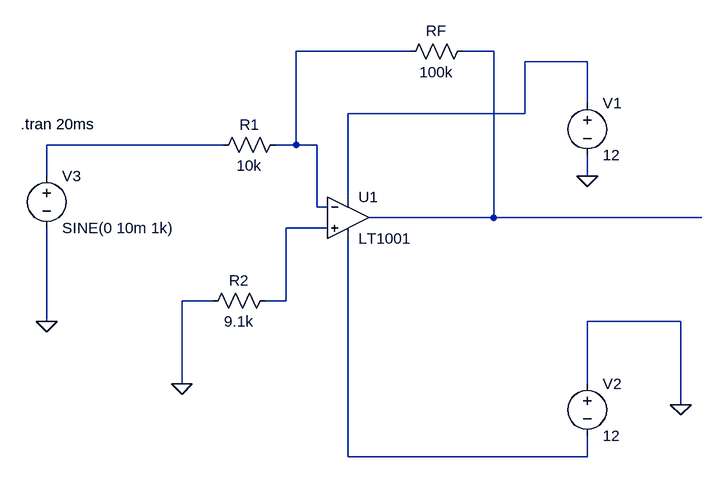
[diagram p0: schematic inverting amplifier.asc]
inverting amplifier.asc, the LTspice schematic file:
Version 4
SHEET 1 880 680
WIRE 320 -128 144 -128
WIRE 448 -128 400 -128
WIRE 592 -112 496 -112
WIRE 592 -48 592 -112
WIRE 496 -32 496 -112
WIRE 496 -32 224 -32
WIRE 32 16 -240 16
WIRE 144 16 144 -128
WIRE 144 16 112 16
WIRE 176 16 144 16
WIRE -240 64 -240 16
WIRE 592 64 592 32
WIRE 224 96 224 -32
WIRE 176 112 176 16
WIRE 192 112 176 112
WIRE 448 128 448 -128
WIRE 448 128 256 128
WIRE 768 128 448 128
WIRE 192 144 128 144
WIRE 16 256 -32 256
WIRE 128 256 128 144
WIRE 128 256 96 256
WIRE -240 288 -240 144
WIRE 736 288 592 288
WIRE -32 384 -32 256
WIRE 592 384 592 288
WIRE 736 416 736 288
WIRE 224 496 224 160
WIRE 592 496 592 464
WIRE 592 496 224 496
FLAG -240 288 0
FLAG -32 384 0
FLAG 736 416 0
FLAG 592 64 0
SYMBOL Opamps\\LT1001 224 64 R0
SYMATTR InstName U1
SYMBOL voltage 592 -64 R0
WINDOW 123 0 0 Left 0
WINDOW 39 0 0 Left 0
SYMATTR InstName V1
SYMATTR Value 12
SYMBOL voltage 592 368 R0
WINDOW 123 0 0 Left 0
WINDOW 39 0 0 Left 0
SYMATTR InstName V2
SYMATTR Value 12
SYMBOL voltage -240 48 R0
WINDOW 123 0 0 Left 0
WINDOW 39 0 0 Left 0
SYMATTR InstName V3
SYMATTR Value SINE(0 10m 1k)
SYMBOL res 128 0 R90
WINDOW 0 0 56 VBottom 2
WINDOW 3 32 56 VTop 2
SYMATTR InstName R1
SYMATTR Value 10k
SYMBOL res 112 240 R90
WINDOW 0 0 56 VBottom 2
WINDOW 3 32 56 VTop 2
SYMATTR InstName R2
SYMATTR Value 9.1k
SYMBOL res 416 -144 R90
WINDOW 0 0 56 VBottom 2
WINDOW 3 32 56 VTop 2
SYMATTR InstName RF
SYMATTR Value 100k
TEXT -280 -16 Left 2 !.tran 20ms

The netlist it stands for:
* inverting amplifier.asc
XU1 N005 N001 N003 N006 N002 LT1001  ; pins In+ In- V+ V- OUT
V1 N003 0 12
V2 0 N006 12
V3 N004 0 SINE(0 10m 1k)
R1 N001 N004 10k
R2 N005 0 9.1k
RF N002 N001 100k
.tran 20ms
.lib LTC.lib
.backanno
.end